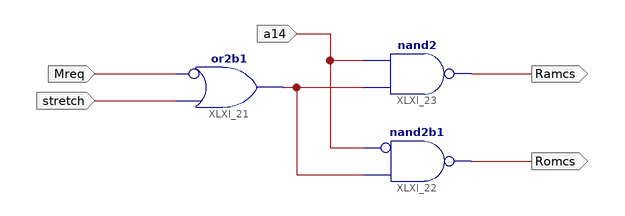
[diagram p0: schematic sheet 1]
// Xilinx ISE schematic memory_select.sch (xc9500) as structural Verilog: 3 symbols, 5 ports
module memory_select (
  input  Mreq,
  input  a14,
  input  stretch,
  output Ramcs,
  output Romcs
);

  wire XLXN_9;

  or XLXI_21 (XLXN_9, ~Mreq, stretch);  // or2b1
  nand XLXI_22 (Romcs, ~a14, XLXN_9);  // nand2b1
  nand XLXI_23 (Ramcs, XLXN_9, a14);
endmodule
